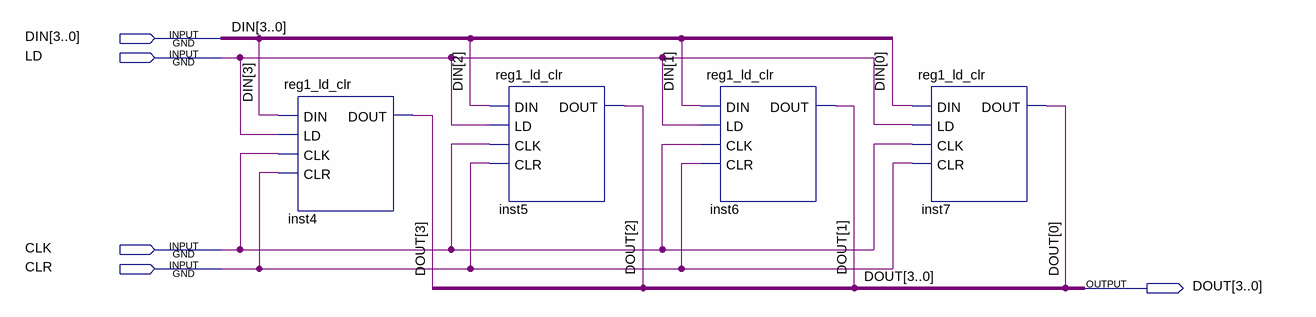
[diagram p0: schematic sheet]
// Quartus schematic reg4_ld_clr.bdf as structural Verilog: 4 symbols, 5 pins
module reg4_ld_clr (
  input  [3:0] DIN,
  input  LD,
  input  CLK,
  input  CLR,
  output [3:0] DOUT
);

  reg1_ld_clr inst4 (.DIN(DIN[3]), .LD(LD), .CLK(CLK), .CLR(CLR), .DOUT(DOUT[3]));
  reg1_ld_clr inst5 (.DIN(DIN[2]), .LD(LD), .CLK(CLK), .CLR(CLR), .DOUT(DOUT[2]));
  reg1_ld_clr inst6 (.DIN(DIN[1]), .LD(LD), .CLK(CLK), .CLR(CLR), .DOUT(DOUT[1]));
  reg1_ld_clr inst7 (.DIN(DIN[0]), .LD(LD), .CLK(CLK), .CLR(CLR), .DOUT(DOUT[0]));
endmodule
